# Altium project ZQ_FOC_V3.PrjPcb
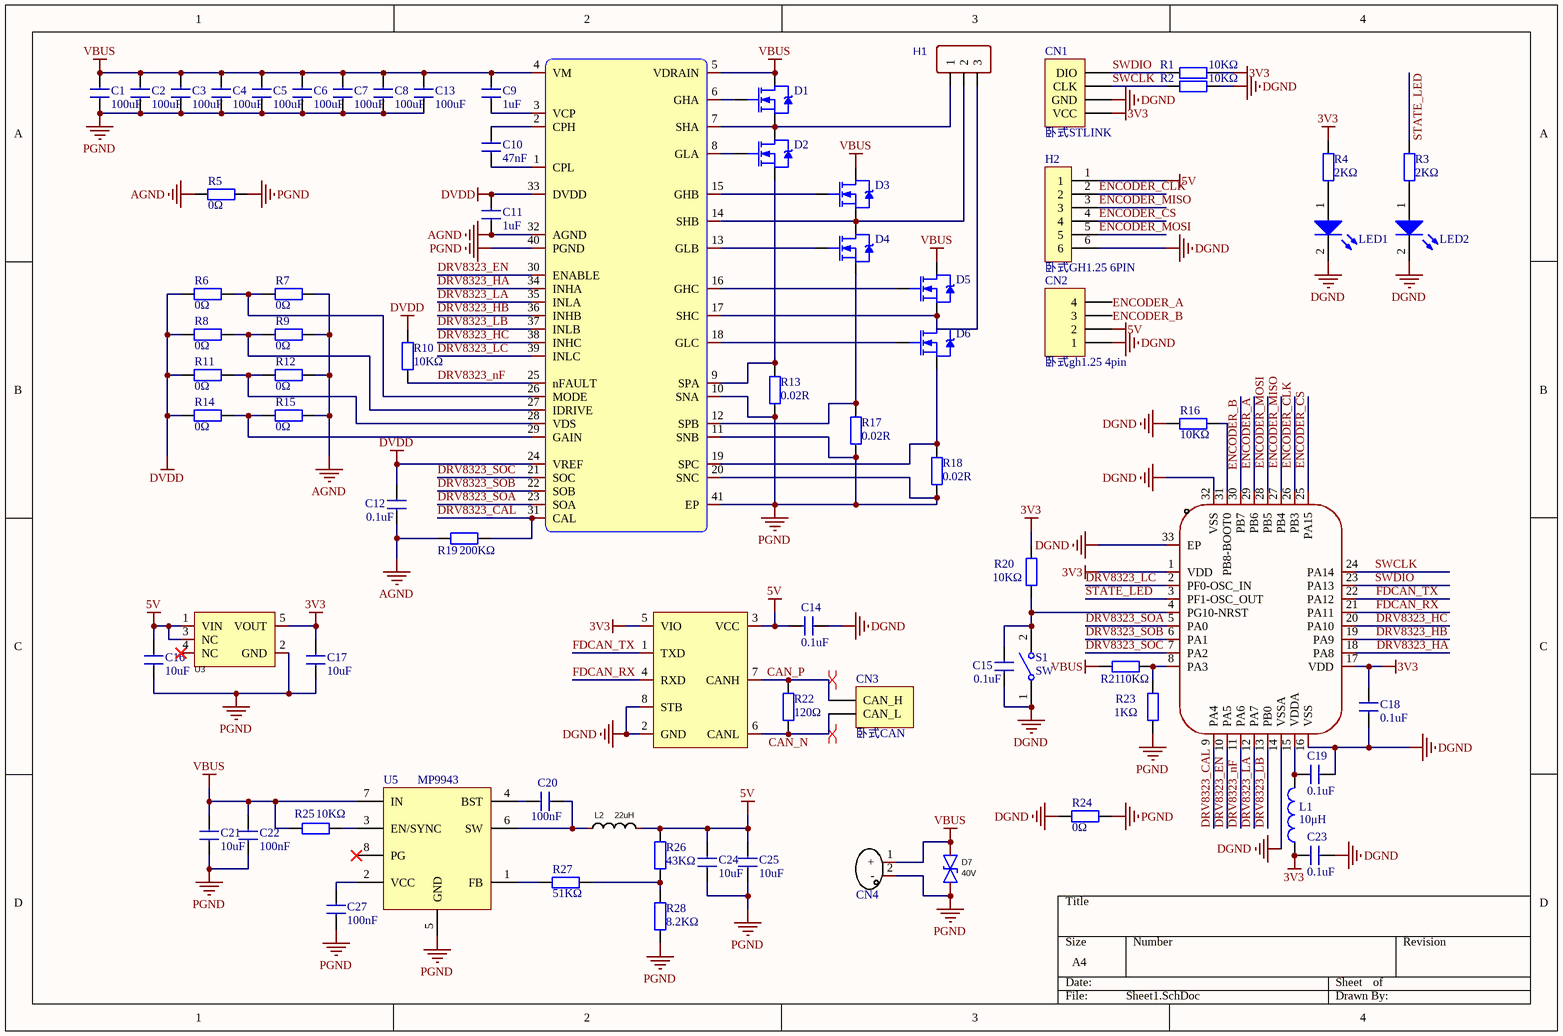
[diagram p0: Sheet1.SchDoc]
1 sheet, 77 parts. Net scope: global (net labels, ports and power ports of the same name join across sheets).
Board file: PCB1.PcbDoc

## Sheet Sheet1.SchDoc
size A4; SheetNumber: 1; SheetTotal: 1

### Parts
C1  100uF  [1210]
C2  100uF  [1210]
C3  100uF  [1210]
C4  100uF  [1210]
C5  100uF  [1210]
C6  100uF  [1210]
C7  100uF  [1210]
C8  100uF  [1210]
C9  1uF  [c0402]
C10  47nF  [c0402]
C11  1uF  [c0402]
C12  0.1uF  [c0402]
C13  100uF  [1210]
C14  0.1uF  [c0402]
C15  0.1uF  [c0402]
C16  10uF  [c0402]
C17  10uF  [c0402]
C18  0.1uF  [c0402]
C19  0.1uF  [c0402]
C20  100nF  [c0402]
C21  10uF  [1210]
C22  100nF  [c0402]
C23  0.1uF  [c0402]
C24  10uF  [1210]
C25  10uF  [1210]
C27  100nF  [c0402]
CN1  卧式STLINK  [CONN-SMD_4P-P1.25_GH1.25-4P]
CN2  卧式gh1.25 4pin  [CONN-SMD_4P-P1.25_GH1.25-4P]
CN3  卧式CAN  [A1257WR-S-2P]
CN4  卧贴立式XT30母头  [CONN-TH_XT30U-M _Sleep]  (value not drawn)
D1  CSD18540  [pg-tdson-8]  (value not drawn)
D2  CSD18540  [pg-tdson-8]  (value not drawn)
D3  CSD18540  [pg-tdson-8]  (value not drawn)
D4  CSD18540  [pg-tdson-8]  (value not drawn)
D5  CSD18540  [pg-tdson-8]  (value not drawn)
D6  CSD18540  [pg-tdson-8]  (value not drawn)
D7  40V  [SMB_L4.6-W3.6-LS5.3-BI]
H1  MR30-M  [MR30]  (value not drawn)
H2  卧式GH1.25 6PIN  [CONN-SMD_6P-P1.25_XYECONN_XY-GH1.25-6A61]
L1  10μH  [L0805]
L2  22uH  [IND-SMD_L5.4-W5.2]
LED1  LED  [led0805]  (value not drawn)
LED2  LED  [led0805]  (value not drawn)
R1  10KΩ  [R0402]
R2  10KΩ  [R0402]
R3  2KΩ  [R0402]
R4  2KΩ  [R0402]
R5  0Ω  [R0402]
R6  0Ω  [R0402]
R7  0Ω  [R0402]
R8  0Ω  [R0402]
R9  0Ω  [R0402]
R10  10KΩ  [R0402]
R11  0Ω  [R0402]
R12  0Ω  [R0402]
R13  0.02R  [R 2512_M]
R14  0Ω  [R0402]
R15  0Ω  [R0402]
R16  10KΩ  [R0402]
R17  0.02R  [R 2512_M]
R18  0.02R  [R 2512_M]
R19  200KΩ  [R0402]
R20  10KΩ  [R0402]
R21  10KΩ  [R0402]
R22  120Ω  [R0402]
R23  1KΩ  [R0402]
R24  0Ω  [R0402]
R25  10KΩ  [R0402]
R26  43KΩ  [R0402]
R27  51KΩ  [R0402]
R28  8.2KΩ  [R0402]
S1  SW  [KEY_SMD]
U1  STM32G431KBU3  [UFQFPN-32_L5.0-W5.0-P0.50-BL-EP3.5]  (value not drawn)
U2  DRV8323HRTAR  [QFN-40_L6.0-W6.0-P0.50-BL-EP4.5]  (value not drawn)
U3  XC6201P332MR-HXY  [SOT-23-5_L3.0-W1.7-P0.95-LS2.8-BR]  (value not drawn)
U4  TCAN1042VDRQ1  [SOIC-8_L4.9-W3.9-P1.27-LS6.0-BL]  (value not drawn)
U5  MP9943  [QFN-8 3x3]

### Nets
3V3: C17.2 C18.1 C23.2 CN1.1(VCC) L1.1 R1.2 R4.1 R20.1 U1.1(VDD) U1.17(VDD) U3.5(VOUT) U4.5(VIO)
5V: C14.2 C16.2 C24.2 C25.2 CN2.2 H2.1 L2.2 R26.2 U3.1(VIN) U3.3(NC) U4.3(VCC)
AGND: C11.1 C12.1 R5.1 R7.2 R9.2 R12.2 R15.2 R19.2 U2.32(AGND)
DGND: C14.1 C15.1 C18.2 C19.1 C23.1 CN1.2(GND) CN2.1 H2.6 LED1.2(K) LED2.2(K) R2.2 R16.1 R24.1 S1.1(COMMON) U1.14(VSSA) U1.16(VSS) U1.32(VSS) U1.33(EP) U4.2(GND) U4.8(STB)
DVDD: C11.2 C12.2 R6.1 R8.1 R10.1 R11.1 R14.1 U2.24(VREF) U2.33(DVDD)
PGND: C1.1 C2.1 C3.1 C4.1 C5.1 C6.1 C7.1 C8.1 C13.1 C16.1 C17.1 C21.1 C22.1 C24.1 C25.1 C27.1 CN4.2(-) D7.2(A) R5.2 R13.1 R17.1 R18.1 R23.2 R24.2 R28.1 U2.10(SNA) U2.11(SNB) U2.20(SNC) U2.40(PGND) U2.41(EP) U3.2(GND) U5.5(GND)
VBUS: C1.2 C2.2 C3.2 C4.2 C5.2 C6.2 C7.2 C8.2 C9.2 C13.2 C21.2 C22.2 CN4.1(+) D1.2(D) D3.2(D) D5.2(D) D7.1(K) R21.2 R25.1 U2.4(VM) U2.5(VDRAIN) U5.7(IN)
CAN_N: CN3.2(CAN_L) R22.1 U4.6(CANL)
CAN_P: CN3.1(CAN_H) R22.2 U4.7(CANH)
DRV8323_CAL: R19.1 U1.9(PA4) U2.31(CAL)
DRV8323_EN: U1.10(PA5) U2.30(ENABLE)
DRV8323_HA: U1.18(PA8) U2.34(INHA)
DRV8323_HB: U1.19(PA9) U2.36(INHB)
DRV8323_HC: U1.20(PA10) U2.38(INHC)
DRV8323_LA: U1.12(PA7) U2.35(INLA)
DRV8323_LB: U1.13(PB0) U2.37(INLB)
DRV8323_LC: U1.2(PF0-OSC_IN) U2.39(INLC)
DRV8323_nF: R10.2 U1.11(PA6) U2.25(nFAULT)
DRV8323_SOA: U1.5(PA0) U2.23(SOA)
DRV8323_SOB: U1.6(PA1) U2.22(SOB)
DRV8323_SOC: U1.7(PA2) U2.21(SOC)
ENCODER_A: CN2.4 U1.29(PB6)
ENCODER_B: CN2.3 U1.30(PB7)
ENCODER_CLK: H2.2 U1.26(PB3)
ENCODER_CS: H2.4 U1.25(PA15)
ENCODER_MISO: H2.3 U1.27(PB4)
ENCODER_MOSI: H2.5 U1.28(PB5)
FDCAN_RX: U1.21(PA11) U4.4(RXD)
FDCAN_TX: U1.22(PA12) U4.1(TXD)
STATE_LED: R3.1 U1.3(PF1-OSC_OUT)
SWCLK: CN1.3(CLK) R2.1 U1.24(PA14)
SWDIO: CN1.4(DIO) R1.1 U1.23(PA13)
NetC9_1: C9.1 U2.3(VCP)
NetC10_1: C10.1 U2.1(CPL)
NetC10_2: C10.2 U2.2(CPH)
NetC15_2: C15.2 R20.2 S1.2(NO) U1.4(PG10-NRST)
NetC19_2: C19.2 L1.2 U1.15(VDDA)
NetC20_1: C20.1 U5.4(BST)
NetC20_2: C20.2 L2.1 U5.6(SW)
NetC27_2: C27.2 U5.2(VCC)
NetD1_1: D1.1(G) U2.6(GHA)
NetD1_3: D1.3(S) D2.2(D) H1.1 U2.7(SHA)
NetD2_1: D2.1(G) U2.8(GLA)
NetD2_3: D2.3(S) R13.2 U2.9(SPA)
NetD3_1: D3.1(G) U2.15(GHB)
NetD3_3: D3.3(S) D4.2(D) H1.2 U2.14(SHB)
NetD4_1: D4.1(G) U2.13(GLB)
NetD4_3: D4.3(S) R17.2 U2.12(SPB)
NetD5_1: D5.1(G) U2.16(GHC)
NetD5_3: D5.3(S) D6.2(D) H1.3 U2.17(SHC)
NetD6_1: D6.1(G) U2.18(GLC)
NetD6_3: D6.3(S) R18.2 U2.19(SPC)
NetLED1_1: LED1.1(A) R4.2
NetLED2_1: LED2.1(A) R3.2
NetR6_2: R6.2 R7.1 U2.26(MODE)
NetR8_2: R8.2 R9.1 U2.27(IDRIVE)
NetR11_2: R11.2 R12.1 U2.28(VDS)
NetR14_2: R14.2 R15.1 U2.29(GAIN)
NetR16_2: R16.2 U1.31(PB8-BOOT0)
NetR21_1: R21.1 R23.1 U1.8(PA3)
NetR25_2: R25.2 U5.3(EN/SYNC)
NetR26_1: R26.1 R27.2 R28.2
NetR27_1: R27.1 U5.1(FB)

Not connected (* = marked no-connect by the designer): U3 4(NC)*; U5 8(PG)*

### Layout directives
differential pair: CAN_N, CAN_P

### Library data of the parts
C1-C8 C13 C21 C24 C25 = 1210贴片电容
C9-C12 C14-C20 C22 C23 C27 = 0402贴片电容: 贴片电容0402
D1-D6 = CSD18540: N沟道MOS管; Note: Pin 2 is electrically connected to pin 4.; Published: 8-Jun-2000; LatestRevisionDate: 17-Jul-2002; LatestRevisionNote: Re-released for DXP Platform.; DatasheetVersion: PD-9.814; PackageVersion: Feb-1997; PackageReference: TO-220AB; Publisher: Altium Limited; PackageDescription: TO, Thru-Hole, Vertical, Heatsink Mounted; 3 In-Line Leads; Pitch 2.54 mm; ComponentLink1Description: Manufacturer Link; ComponentLink1URL: http://www.irf.com/
D7 = P6SMB30CA: 28V 双向TVS; Manufacturer: Littelfuse(美国力特); Device: P6SMB30CA_C80384; Add into BOM: yes; Reverse Stand-Off Voltage (Vrwm): 25.6V; Maximum Clamping Voltage: 41.4V; Peak Pulse Current (Ipp)@10/1000us: 14.7A; Peak Pulse Power Dissipation (Ppp)@10/1000us: 600W; Breakdown Voltage: 28.5V; Type: TVS; Symbol: P6SMB30CA; LCSC Part Name: P6SMB30CA; Supplier Part: C80384; Manufacturer Part: P6SMB30CA; Supplier Footprint: SMB(DO-214AA); JLCPCB Part Class: Extended Part; Datasheet: https://atta.szlcsc.com/upload/public/pdf/source/20170919/C130399_1505787216040976929.pdf; Supplier: LCSC; Convert to PCB: yes
H1 = MR30-M: BOM_Manufacturer: AMASS(艾迈斯); Contributor: LCEDA_Lib; BOM_Supplier Part: C99873; BOM_Supplier: LCSC; BOM_Manufacturer Part: MR30-M; spicePre: H; spiceSymbolName: HDR-F-2.54_1x3
L1 = 0805贴片电感
L2 = 0530屏蔽电感: 一体成型屏蔽电感，0530封装，额定电流3A; Manufacturer: XR(祥如); Symbol: XR0530-100M; Add into BOM: yes; Value: 10uH; Tolerance: ±20%; Rated Current: 3.2A; Saturation Current (Isat): 3.5A; DC Resistance (DCR): 125mΩ; Type: 一体成型电感; Device: XR0530-100M; LCSC Part Name: 10uH ±20% 3.5A; Supplier Part: C5307602; Manufacturer Part: XR0530-100M; Supplier Footprint: SMD,0530; JLCPCB Part Class: Extended Part; Datasheet: https://atta.szlcsc.com/upload/public/pdf/source/20240328/42FE63A3232C4AF7EB8F1CDEDD5FC69F.pdf; Supplier: LCSC; Convert to PCB: yes
LED1 LED2 = 0805贴片LED
R1-R12 R14-R16 R19-R28 = 0402贴片电阻: W: *
R13 R17 R18 = 2512检流电阻
S1 = SW: 开关
U1 = STM32G431KBU3: Manufacturer: ST(意法半导体); Add into BOM: yes; CPU Core: ARM-M4; CPU Maximum Speed: 170MHz; Program Storage Size: 128KB; Program Memory Type: FLASH; Number of I/O: 26; ADC (Bit): 12bit; Low Voltage Detection Threshold: 1.71V~3.6V; Symbol: STM32G431KBU3; Device: STM32G431KBU3; LCSC Part Name: 带DSP和FPU的170MHz主流ARM Cortex-M4 MCU，具有128 KB Flash存储器、数学加速器和中等模拟电平集成; Supplier Part: C1341901; Manufacturer Part: STM32G431KBU3; Supplier Footprint: UFQFPN-32(5x5); JLCPCB Part Class: Extended Part; Datasheet: https://atta.szlcsc.com/upload/public/pdf/source/20210607/F3CD0646E5D00AAFDE875C196C2D7333.pdf; Supplier: LCSC; Convert to PCB: yes; DAC (Bit): 12bit; Application Area: -
U2 = DRV8323HRTAR: Manufacturer: TI(德州仪器); Add into BOM: yes; Symbol: DRV8323HRTAR; Device: DRV8323HRTAR; LCSC Part Name: 5mA 无刷直流BLDC电机驱动芯片 60V; Supplier Part: C701783; Manufacturer Part: DRV8323HRTAR; Supplier Footprint: QFN-40-EP(6x6); JLCPCB Part Class: Extended Part; Datasheet: https://www.ti.com/cn/lit/gpn/drv8323; Supplier: LCSC; Convert to PCB: yes
U3 = XC6201P332MR-HXY: 3.3V LDO; Manufacturer: HXY MOSFET(华轩阳电子); Add into BOM: yes; Output Type: 固定; Maximum Input Voltage: 12V; MAX Output Current: 300mA; Output Polarity: 正极; Symbol: XC6201P332MR-HXY; Device: XC6201P332MR-HXY; LCSC Part Name: XC6201P332MR-HXY; Supplier Part: C19626990; Manufacturer Part: XC6201P332MR-HXY; Supplier Footprint: SOT-23-5L; JLCPCB Part Class: Extended Part; Datasheet: https://atta.szlcsc.com/upload/public/pdf/source/20231208/3D7EFECB06481ED5AED4680614D7FFF5.pdf; Supplier: LCSC; Convert to PCB: yes; Output Voltage: 3.3V
U4 = TCAN1042VDRQ1: Manufacturer: TI(德州仪器); Add into BOM: yes; Supply Voltage: 4.5V~5.5V; Symbol: TCAN1042VDRQ1; Device: TCAN1042VDRQ1; LCSC Part Name: TCAN1042-Q1 汽车故障保护 CAN 收发器，带 CAN FD; Supplier Part: C485806; Manufacturer Part: TCAN1042VDRQ1; Supplier Footprint: SOIC-8; JLCPCB Part Class: Extended Part; Datasheet: https://www.ti.com/cn/lit/gpn/tcan1042hv-q1; Supplier: LCSC; Convert to PCB: yes; Type: -; Data Rate: -; Supply Current: -; Operating Temperature: -55℃~+125℃
CN3 = 卧式CAN: LatestRevisionDate: 17-Jul-2002; LatestRevisionNote: Re-released for DXP Platform.; Publisher: Altium Limited